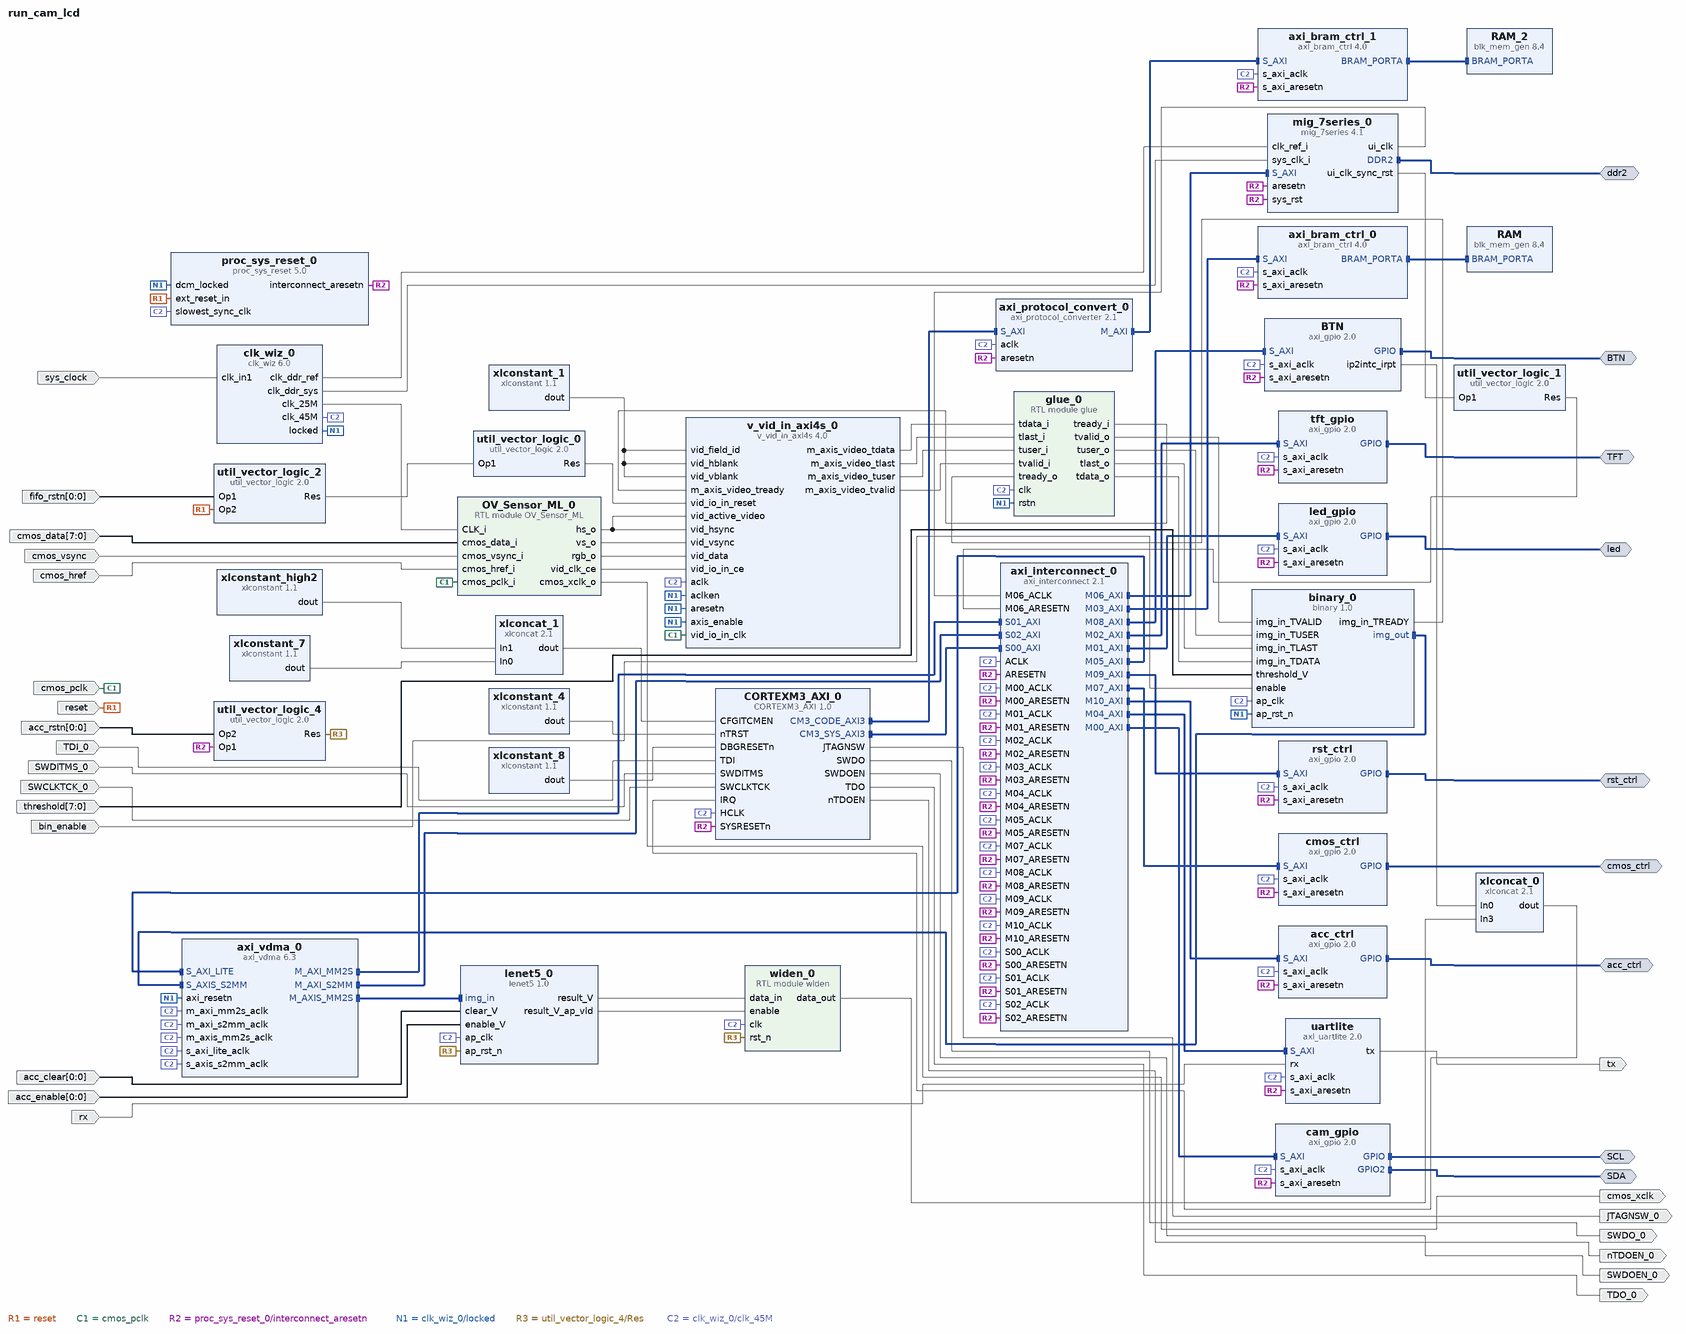
[diagram p0: block diagram of the top level]
# Vivado block design run_cam_lcd, xc7a100tcsg324-1, Vivado 2018.2
create_bd_design run_cam_lcd

create_bd_intf_port -mode Master -vlnv xilinx.com:interface:gpio_rtl:1.0 led
create_bd_intf_port -mode Master -vlnv xilinx.com:interface:gpio_rtl:1.0 TFT
create_bd_intf_port -mode Master -vlnv xilinx.com:interface:ddrx_rtl:1.0 ddr2
create_bd_intf_port -mode Master -vlnv xilinx.com:interface:gpio_rtl:1.0 SCL
create_bd_intf_port -mode Master -vlnv xilinx.com:interface:gpio_rtl:1.0 SDA
create_bd_intf_port -mode Master -vlnv xilinx.com:interface:gpio_rtl:1.0 cmos_ctrl
create_bd_intf_port -mode Master -vlnv xilinx.com:interface:gpio_rtl:1.0 BTN
create_bd_intf_port -mode Master -vlnv xilinx.com:interface:gpio_rtl:1.0 acc_ctrl
create_bd_intf_port -mode Master -vlnv xilinx.com:interface:gpio_rtl:1.0 rst_ctrl
create_bd_port -dir I -type rst reset
create_bd_port -dir I cmos_pclk
create_bd_port -dir I -type clk sys_clock
create_bd_port -dir I -from 7 -to 0 cmos_data
create_bd_port -dir I cmos_vsync
create_bd_port -dir I cmos_href
create_bd_port -dir O cmos_xclk
create_bd_port -dir I TDI_0
create_bd_port -dir I SWDITMS_0
create_bd_port -dir I -type clk SWCLKTCK_0
create_bd_port -dir O JTAGNSW_0
create_bd_port -dir O SWDO_0
create_bd_port -dir O SWDOEN_0
create_bd_port -dir O TDO_0
create_bd_port -dir O nTDOEN_0
create_bd_port -dir I rx
create_bd_port -dir O tx
create_bd_port -dir I -from 0 -to 0 fifo_rstn
create_bd_port -dir I -from 0 -to 0 acc_rstn
create_bd_port -dir I -from 0 -to 0 -type data acc_clear
set_property -dict [list \
  CONFIG.LAYERED_METADATA {xilinx.com:interface:datatypes:1.0 {DATA {datatype {name {attribs {resolve_type immediate dependency {} format string minimum {} maximum {}} value {}} bitwidth {attribs {resolve_type immediate dependency {} format long minimum {} maximum {}} value 1} bitoffset {attribs {resolve_type immediate dependency {} format long minimum {} maximum {}} value 0}}}}} \
] [get_bd_ports acc_clear]
create_bd_port -dir I -from 0 -to 0 -type data acc_enable
set_property -dict [list \
  CONFIG.LAYERED_METADATA {xilinx.com:interface:datatypes:1.0 {DATA {datatype {name {attribs {resolve_type immediate dependency {} format string minimum {} maximum {}} value {}} bitwidth {attribs {resolve_type immediate dependency {} format long minimum {} maximum {}} value 1} bitoffset {attribs {resolve_type immediate dependency {} format long minimum {} maximum {}} value 0}}}}} \
] [get_bd_ports acc_enable]
create_bd_port -dir I -from 7 -to 0 -type data threshold
set_property -dict [list \
  CONFIG.LAYERED_METADATA {xilinx.com:interface:datatypes:1.0 {DATA {datatype {name {attribs {resolve_type immediate dependency {} format string minimum {} maximum {}} value {}} bitwidth {attribs {resolve_type immediate dependency {} format long minimum {} maximum {}} value 8} bitoffset {attribs {resolve_type immediate dependency {} format long minimum {} maximum {}} value 0} integer {signed {attribs {resolve_type immediate dependency {} format bool minimum {} maximum {}} value false}}}}}} \
] [get_bd_ports threshold]
create_bd_port -dir I -type data bin_enable
set_property -dict [list \
  CONFIG.LAYERED_METADATA {xilinx.com:interface:datatypes:1.0 {DATA {datatype {name {attribs {resolve_type immediate dependency {} format string minimum {} maximum {}} value {}} bitwidth {attribs {resolve_type immediate dependency {} format long minimum {} maximum {}} value 1} bitoffset {attribs {resolve_type immediate dependency {} format long minimum {} maximum {}} value 0}}}}} \
] [get_bd_ports bin_enable]

create_bd_cell -type ip -vlnv xilinx.com:ip:clk_wiz:6.0 clk_wiz_0
set_property -dict [list \
  CONFIG.CLKOUT2_USED true \
  CONFIG.CLKOUT3_USED true \
  CONFIG.CLKOUT4_USED true \
  CONFIG.CLKOUT5_USED false \
  CONFIG.NUM_OUT_CLKS 4 \
  CONFIG.CLK_OUT1_PORT clk_25M \
  CONFIG.CLK_OUT2_PORT clk_45M \
  CONFIG.CLK_OUT3_PORT clk_ddr_ref \
  CONFIG.CLK_OUT4_PORT clk_ddr_sys \
  CONFIG.CLK_OUT5_PORT sys_tick \
  CONFIG.CLKOUT1_REQUESTED_OUT_FREQ 25.000 \
  CONFIG.CLKOUT2_REQUESTED_OUT_FREQ 40 \
  CONFIG.CLKOUT3_REQUESTED_OUT_FREQ 200.000 \
  CONFIG.CLKOUT5_REQUESTED_OUT_FREQ 10.000 \
  CONFIG.CLKOUT5_REQUESTED_PHASE 0 \
  CONFIG.CLKOUT1_DRIVES BUFGCE \
  CONFIG.CLKOUT2_DRIVES BUFGCE \
  CONFIG.CLKOUT3_DRIVES BUFGCE \
  CONFIG.CLKOUT4_DRIVES BUFGCE \
  CONFIG.CLKOUT5_DRIVES BUFGCE \
  CONFIG.CLKOUT6_DRIVES BUFGCE \
  CONFIG.CLKOUT7_DRIVES BUFGCE \
  CONFIG.FEEDBACK_SOURCE FDBK_AUTO \
  CONFIG.USE_RESET false \
  CONFIG.RESET_PORT resetn \
  CONFIG.MMCM_DIVCLK_DIVIDE 1 \
  CONFIG.MMCM_CLKFBOUT_MULT_F 10.000 \
  CONFIG.MMCM_CLKIN1_PERIOD 10.000 \
  CONFIG.MMCM_CLKIN2_PERIOD 10.000 \
  CONFIG.MMCM_CLKOUT0_DIVIDE_F 40.000 \
  CONFIG.MMCM_CLKOUT1_DIVIDE 25 \
  CONFIG.MMCM_CLKOUT2_DIVIDE 5 \
  CONFIG.MMCM_CLKOUT3_DIVIDE 10 \
  CONFIG.MMCM_CLKOUT4_DIVIDE 1 \
  CONFIG.MMCM_CLKOUT4_PHASE 0.000 \
  CONFIG.RESET_TYPE ACTIVE_LOW \
  CONFIG.USE_SAFE_CLOCK_STARTUP true \
  CONFIG.CLKOUT1_JITTER 175.402 \
  CONFIG.CLKOUT1_PHASE_ERROR 98.575 \
  CONFIG.CLKOUT2_JITTER 159.371 \
  CONFIG.CLKOUT2_PHASE_ERROR 98.575 \
  CONFIG.CLKOUT3_JITTER 114.829 \
  CONFIG.CLKOUT3_PHASE_ERROR 98.575 \
  CONFIG.CLKOUT4_JITTER 130.958 \
  CONFIG.CLKOUT4_PHASE_ERROR 98.575 \
  CONFIG.CLKOUT5_JITTER 209.588 \
  CONFIG.CLKOUT5_PHASE_ERROR 98.575 \
] [get_bd_cells clk_wiz_0]
create_bd_cell -type ip -vlnv xilinx.com:ip:proc_sys_reset:5.0 proc_sys_reset_0
create_bd_cell -type ip -vlnv Arm.com:CortexM:CORTEXM3_AXI:1.0 CORTEXM3_AXI_0
set_property -dict [list \
  CONFIG.JTAG_PRESENT true \
  CONFIG.ITCM_INIT_RAM false \
  CONFIG.TRACE_LVL 2 \
  CONFIG.DEBUG_LVL 2 \
] [get_bd_cells CORTEXM3_AXI_0]
create_bd_cell -type ip -vlnv xilinx.com:ip:axi_interconnect:2.1 axi_interconnect_0
set_property -dict [list \
  CONFIG.NUM_SI 3 \
  CONFIG.NUM_MI 11 \
  CONFIG.ENABLE_ADVANCED_OPTIONS 0 \
  CONFIG.XBAR_DATA_WIDTH 32 \
  CONFIG.SYNCHRONIZATION_STAGES 2 \
  CONFIG.M00_HAS_REGSLICE 3 \
  CONFIG.M01_HAS_REGSLICE 3 \
  CONFIG.M02_HAS_REGSLICE 3 \
  CONFIG.M03_HAS_REGSLICE 3 \
  CONFIG.M04_HAS_REGSLICE 3 \
  CONFIG.M05_HAS_REGSLICE 3 \
  CONFIG.M06_HAS_REGSLICE 3 \
  CONFIG.M07_HAS_REGSLICE 3 \
  CONFIG.M03_HAS_DATA_FIFO 0 \
  CONFIG.S00_HAS_REGSLICE 3 \
  CONFIG.S01_HAS_REGSLICE 3 \
  CONFIG.S02_HAS_REGSLICE 3 \
] [get_bd_cells axi_interconnect_0]
create_bd_cell -type ip -vlnv xilinx.com:ip:v_vid_in_axi4s:4.0 v_vid_in_axi4s_0
set_property -dict [list \
  CONFIG.C_M_AXIS_VIDEO_DATA_WIDTH 8 \
  CONFIG.C_NATIVE_COMPONENT_WIDTH 8 \
  CONFIG.C_HAS_ASYNC_CLK 1 \
  CONFIG.C_ADDR_WIDTH 10 \
] [get_bd_cells v_vid_in_axi4s_0]
create_bd_cell -type ip -vlnv xilinx.com:ip:xlconcat:2.1 xlconcat_0
set_property -dict {CONFIG.NUM_PORTS 4 CONFIG.IN4_WIDTH 10} [get_bd_cells xlconcat_0]
create_bd_cell -type ip -vlnv xilinx.com:ip:axi_gpio:2.0 led_gpio
set_property -dict {CONFIG.C_GPIO_WIDTH 5 CONFIG.C_ALL_OUTPUTS 1} [get_bd_cells led_gpio]
create_bd_cell -type ip -vlnv xilinx.com:ip:axi_gpio:2.0 tft_gpio
set_property -dict {CONFIG.C_GPIO_WIDTH 4 CONFIG.C_ALL_OUTPUTS 1} [get_bd_cells tft_gpio]
create_bd_cell -type ip -vlnv xilinx.com:ip:axi_protocol_converter:2.1 axi_protocol_convert_0
create_bd_cell -type ip -vlnv xilinx.com:ip:axi_bram_ctrl:4.0 axi_bram_ctrl_1
set_property -dict {CONFIG.SINGLE_PORT_BRAM 1} [get_bd_cells axi_bram_ctrl_1]
create_bd_cell -type ip -vlnv xilinx.com:ip:blk_mem_gen:8.4 RAM_2
set_property -dict [list \
  CONFIG.Memory_Type Single_Port_RAM \
  CONFIG.Port_A_Write_Rate 50 \
  CONFIG.EN_SAFETY_CKT false \
] [get_bd_cells RAM_2]
create_bd_cell -type ip -vlnv xilinx.com:ip:mig_7series:4.1 mig_7series_0
set_property -dict [list \
  CONFIG.XML_INPUT_FILE mig_a.prj \
  CONFIG.RESET_BOARD_INTERFACE Custom \
  CONFIG.MIG_DONT_TOUCH_PARAM Custom \
  CONFIG.BOARD_MIG_PARAM Custom \
] [get_bd_cells mig_7series_0]
create_bd_cell -type ip -vlnv xilinx.com:ip:xlconcat:2.1 xlconcat_1
create_bd_cell -type ip -vlnv xilinx.com:ip:xlconstant:1.1 xlconstant_high2
set_property -dict {CONFIG.CONST_VAL 0} [get_bd_cells xlconstant_high2]
create_bd_cell -type ip -vlnv xilinx.com:ip:axi_bram_ctrl:4.0 axi_bram_ctrl_0
set_property -dict {CONFIG.SINGLE_PORT_BRAM 1} [get_bd_cells axi_bram_ctrl_0]
create_bd_cell -type ip -vlnv xilinx.com:ip:blk_mem_gen:8.4 RAM
set_property -dict [list \
  CONFIG.Memory_Type Single_Port_RAM \
  CONFIG.Port_A_Write_Rate 50 \
  CONFIG.Port_B_Clock 0 \
  CONFIG.Port_B_Write_Rate 0 \
  CONFIG.Port_B_Enable_Rate 0 \
  CONFIG.EN_SAFETY_CKT false \
] [get_bd_cells RAM]
create_bd_cell -type ip -vlnv xilinx.com:ip:axi_gpio:2.0 cam_gpio
set_property -dict [list \
  CONFIG.C_GPIO_WIDTH 1 \
  CONFIG.C_GPIO2_WIDTH 1 \
  CONFIG.C_IS_DUAL 1 \
  CONFIG.C_ALL_OUTPUTS 1 \
  CONFIG.C_ALL_OUTPUTS_2 0 \
] [get_bd_cells cam_gpio]
create_bd_cell -type module -reference OV_Sensor_ML OV_Sensor_ML_0
create_bd_cell -type ip -vlnv xilinx.com:ip:util_vector_logic:2.0 util_vector_logic_1
set_property -dict {CONFIG.C_SIZE 1 CONFIG.C_OPERATION not} [get_bd_cells util_vector_logic_1]
create_bd_cell -type ip -vlnv xilinx.com:ip:axi_uartlite:2.0 uartlite
create_bd_cell -type ip -vlnv xilinx.com:ip:xlconstant:1.1 xlconstant_4
create_bd_cell -type ip -vlnv xilinx.com:ip:xlconstant:1.1 xlconstant_7
set_property -dict {CONFIG.CONST_VAL 0} [get_bd_cells xlconstant_7]
create_bd_cell -type ip -vlnv xilinx.com:ip:xlconstant:1.1 xlconstant_8
create_bd_cell -type ip -vlnv xilinx.com:ip:axi_gpio:2.0 cmos_ctrl
set_property -dict {CONFIG.C_GPIO_WIDTH 2 CONFIG.C_ALL_OUTPUTS 1} [get_bd_cells cmos_ctrl]
create_bd_cell -type ip -vlnv xilinx.com:ip:util_vector_logic:2.0 util_vector_logic_0
set_property -dict {CONFIG.C_SIZE 1 CONFIG.C_OPERATION not} [get_bd_cells util_vector_logic_0]
create_bd_cell -type ip -vlnv xilinx.com:ip:axi_gpio:2.0 BTN
set_property -dict {CONFIG.C_GPIO_WIDTH 5 CONFIG.C_ALL_INPUTS 1 CONFIG.C_INTERRUPT_PRESENT 1} [get_bd_cells BTN]
create_bd_cell -type ip -vlnv xilinx.com:ip:axi_gpio:2.0 acc_ctrl
set_property -dict {CONFIG.C_GPIO_WIDTH 2 CONFIG.C_ALL_OUTPUTS 1} [get_bd_cells acc_ctrl]
create_bd_cell -type ip -vlnv xilinx.com:ip:util_vector_logic:2.0 util_vector_logic_2
set_property -dict {CONFIG.C_SIZE 1 CONFIG.C_OPERATION and} [get_bd_cells util_vector_logic_2]
create_bd_cell -type ip -vlnv xilinx.com:ip:axi_gpio:2.0 rst_ctrl
set_property -dict {CONFIG.C_GPIO_WIDTH 3 CONFIG.C_DOUT_DEFAULT 0xFFFFFFFF CONFIG.C_ALL_OUTPUTS 1} [get_bd_cells rst_ctrl]
create_bd_cell -type ip -vlnv xilinx.com:ip:util_vector_logic:2.0 util_vector_logic_4
set_property -dict {CONFIG.C_SIZE 1} [get_bd_cells util_vector_logic_4]
create_bd_cell -type ip -vlnv xilinx.com:ip:xlconstant:1.1 xlconstant_1
set_property -dict {CONFIG.CONST_WIDTH 3 CONFIG.CONST_VAL 0} [get_bd_cells xlconstant_1]
create_bd_cell -type module -reference glue glue_0
create_bd_cell -type ip -vlnv xilinx.com:ip:axi_vdma:6.3 axi_vdma_0
set_property -dict [list \
  CONFIG.c_m_axi_mm2s_data_width 32 \
  CONFIG.c_m_axi_s2mm_data_width 32 \
  CONFIG.c_num_fstores 1 \
  CONFIG.c_mm2s_genlock_mode 1 \
  CONFIG.c_s2mm_genlock_mode 0 \
  CONFIG.c_mm2s_max_burst_length 16 \
  CONFIG.c_s2mm_max_burst_length 16 \
] [get_bd_cells axi_vdma_0]
create_bd_cell -type ip -vlnv xilinx.com:hls:lenet5:1.0 lenet5_0
create_bd_cell -type module -reference widen widen_0
create_bd_cell -type ip -vlnv xilinx.com:hls:binary:1.0 binary_0

# ---- connections ----

connect_bd_intf_net [get_bd_intf_pins CORTEXM3_AXI_0/CM3_SYS_AXI3] [get_bd_intf_pins axi_interconnect_0/S00_AXI]
connect_bd_intf_net [get_bd_intf_pins axi_interconnect_0/M01_AXI] [get_bd_intf_pins led_gpio/S_AXI]
connect_bd_intf_net [get_bd_intf_pins axi_interconnect_0/M02_AXI] [get_bd_intf_pins tft_gpio/S_AXI]
connect_bd_intf_net [get_bd_intf_pins CORTEXM3_AXI_0/CM3_CODE_AXI3] [get_bd_intf_pins axi_protocol_convert_0/S_AXI]
connect_bd_intf_net [get_bd_intf_pins axi_protocol_convert_0/M_AXI] [get_bd_intf_pins axi_bram_ctrl_1/S_AXI]
connect_bd_intf_net [get_bd_intf_pins RAM_2/BRAM_PORTA] [get_bd_intf_pins axi_bram_ctrl_1/BRAM_PORTA]
connect_bd_intf_net [get_bd_intf_pins axi_bram_ctrl_0/BRAM_PORTA] [get_bd_intf_pins RAM/BRAM_PORTA]
connect_bd_intf_net [get_bd_intf_pins axi_bram_ctrl_0/S_AXI] [get_bd_intf_pins axi_interconnect_0/M03_AXI]
connect_bd_intf_net [get_bd_intf_pins cam_gpio/S_AXI] [get_bd_intf_pins axi_interconnect_0/M00_AXI]
connect_bd_intf_net [get_bd_intf_pins mig_7series_0/S_AXI] [get_bd_intf_pins axi_interconnect_0/M06_AXI]
connect_bd_intf_net [get_bd_intf_pins uartlite/S_AXI] [get_bd_intf_pins axi_interconnect_0/M04_AXI]
connect_bd_intf_net [get_bd_intf_pins axi_interconnect_0/M07_AXI] [get_bd_intf_pins cmos_ctrl/S_AXI]
connect_bd_intf_net [get_bd_intf_pins axi_interconnect_0/M08_AXI] [get_bd_intf_pins BTN/S_AXI]
connect_bd_intf_net [get_bd_intf_pins acc_ctrl/S_AXI] [get_bd_intf_pins axi_interconnect_0/M10_AXI]
connect_bd_intf_net [get_bd_intf_pins rst_ctrl/S_AXI] [get_bd_intf_pins axi_interconnect_0/M09_AXI]
connect_bd_intf_net [get_bd_intf_pins axi_vdma_0/M_AXI_MM2S] [get_bd_intf_pins axi_interconnect_0/S01_AXI]
connect_bd_intf_net [get_bd_intf_pins axi_vdma_0/M_AXI_S2MM] [get_bd_intf_pins axi_interconnect_0/S02_AXI]
connect_bd_intf_net [get_bd_intf_pins axi_interconnect_0/M05_AXI] [get_bd_intf_pins axi_vdma_0/S_AXI_LITE]
connect_bd_intf_net [get_bd_intf_pins axi_vdma_0/S_AXIS_S2MM] [get_bd_intf_pins binary_0/img_out]
connect_bd_intf_net [get_bd_intf_pins axi_vdma_0/M_AXIS_MM2S] [get_bd_intf_pins lenet5_0/img_in]
connect_bd_intf_net -intf_net axi_gpio_0_GPIO [get_bd_intf_ports led] [get_bd_intf_pins led_gpio/GPIO]
connect_bd_intf_net -intf_net axi_gpio_1_GPIO [get_bd_intf_ports TFT] [get_bd_intf_pins tft_gpio/GPIO]
connect_bd_intf_net [get_bd_intf_ports ddr2] [get_bd_intf_pins mig_7series_0/DDR2]
connect_bd_intf_net [get_bd_intf_ports SCL] [get_bd_intf_pins cam_gpio/GPIO]
connect_bd_intf_net [get_bd_intf_ports SDA] [get_bd_intf_pins cam_gpio/GPIO2]
connect_bd_intf_net -intf_net axi_gpio_0_GPIO1 [get_bd_intf_ports cmos_ctrl] [get_bd_intf_pins cmos_ctrl/GPIO]
connect_bd_intf_net [get_bd_intf_ports BTN] [get_bd_intf_pins BTN/GPIO]
connect_bd_intf_net [get_bd_intf_ports acc_ctrl] [get_bd_intf_pins acc_ctrl/GPIO]
connect_bd_intf_net -intf_net soft_rstn_GPIO [get_bd_intf_ports rst_ctrl] [get_bd_intf_pins rst_ctrl/GPIO]
connect_bd_net -net ext_reset_in_0_1 [get_bd_ports reset] [get_bd_pins proc_sys_reset_0/ext_reset_in] [get_bd_pins util_vector_logic_2/Op2]
connect_bd_net [get_bd_pins clk_wiz_0/clk_25M] [get_bd_pins OV_Sensor_ML_0/CLK_i]
connect_bd_net [get_bd_pins OV_Sensor_ML_0/hs_o] [get_bd_pins v_vid_in_axi4s_0/vid_hsync] [get_bd_pins v_vid_in_axi4s_0/vid_active_video]
connect_bd_net -net cmos_pclk_i_0_1 [get_bd_ports cmos_pclk] [get_bd_pins v_vid_in_axi4s_0/vid_io_in_clk] [get_bd_pins OV_Sensor_ML_0/cmos_pclk_i]
connect_bd_net [get_bd_ports sys_clock] [get_bd_pins clk_wiz_0/clk_in1]
connect_bd_net [get_bd_pins clk_wiz_0/clk_ddr_ref] [get_bd_pins mig_7series_0/clk_ref_i]
connect_bd_net [get_bd_pins clk_wiz_0/clk_ddr_sys] [get_bd_pins mig_7series_0/sys_clk_i]
connect_bd_net [get_bd_pins xlconcat_1/dout] [get_bd_pins CORTEXM3_AXI_0/CFGITCMEN]
connect_bd_net -net xlconstant_2_dout [get_bd_pins xlconstant_high2/dout] [get_bd_pins xlconcat_1/In1]
connect_bd_net [get_bd_pins proc_sys_reset_0/interconnect_aresetn] \
  [get_bd_pins axi_protocol_convert_0/aresetn] [get_bd_pins cam_gpio/s_axi_aresetn] \
  [get_bd_pins axi_bram_ctrl_0/s_axi_aresetn] [get_bd_pins led_gpio/s_axi_aresetn] [get_bd_pins tft_gpio/s_axi_aresetn] \
  [get_bd_pins axi_bram_ctrl_1/s_axi_aresetn] [get_bd_pins CORTEXM3_AXI_0/SYSRESETn] [get_bd_pins uartlite/s_axi_aresetn] \
  [get_bd_pins cmos_ctrl/s_axi_aresetn] [get_bd_pins BTN/s_axi_aresetn] [get_bd_pins acc_ctrl/s_axi_aresetn] \
  [get_bd_pins rst_ctrl/s_axi_aresetn] [get_bd_pins util_vector_logic_4/Op1] [get_bd_pins mig_7series_0/sys_rst] \
  [get_bd_pins mig_7series_0/aresetn] [get_bd_pins axi_interconnect_0/ARESETN] [get_bd_pins axi_interconnect_0/S00_ARESETN] \
  [get_bd_pins axi_interconnect_0/M00_ARESETN] [get_bd_pins axi_interconnect_0/M01_ARESETN] \
  [get_bd_pins axi_interconnect_0/S01_ARESETN] [get_bd_pins axi_interconnect_0/S02_ARESETN] \
  [get_bd_pins axi_interconnect_0/M02_ARESETN] [get_bd_pins axi_interconnect_0/M03_ARESETN] \
  [get_bd_pins axi_interconnect_0/M04_ARESETN] [get_bd_pins axi_interconnect_0/M05_ARESETN] \
  [get_bd_pins axi_interconnect_0/M07_ARESETN] [get_bd_pins axi_interconnect_0/M08_ARESETN] \
  [get_bd_pins axi_interconnect_0/M09_ARESETN] [get_bd_pins axi_interconnect_0/M10_ARESETN]
connect_bd_net [get_bd_ports cmos_data] [get_bd_pins OV_Sensor_ML_0/cmos_data_i]
connect_bd_net [get_bd_ports cmos_vsync] [get_bd_pins OV_Sensor_ML_0/cmos_vsync_i]
connect_bd_net [get_bd_ports cmos_href] [get_bd_pins OV_Sensor_ML_0/cmos_href_i]
connect_bd_net [get_bd_pins OV_Sensor_ML_0/vs_o] [get_bd_pins v_vid_in_axi4s_0/vid_vsync]
connect_bd_net [get_bd_pins OV_Sensor_ML_0/rgb_o] [get_bd_pins v_vid_in_axi4s_0/vid_data]
connect_bd_net [get_bd_pins OV_Sensor_ML_0/vid_clk_ce] [get_bd_pins v_vid_in_axi4s_0/vid_io_in_ce]
connect_bd_net [get_bd_pins OV_Sensor_ML_0/cmos_xclk_o] [get_bd_ports cmos_xclk]
connect_bd_net [get_bd_pins clk_wiz_0/locked] \
  [get_bd_pins v_vid_in_axi4s_0/aclken] [get_bd_pins v_vid_in_axi4s_0/axis_enable] [get_bd_pins v_vid_in_axi4s_0/aresetn] \
  [get_bd_pins proc_sys_reset_0/dcm_locked] [get_bd_pins glue_0/rstn] [get_bd_pins axi_vdma_0/axi_resetn] \
  [get_bd_pins binary_0/ap_rst_n]
connect_bd_net -net TDI_0_1 [get_bd_ports TDI_0] [get_bd_pins CORTEXM3_AXI_0/TDI]
connect_bd_net -net SWDITMS_0_1 [get_bd_ports SWDITMS_0] [get_bd_pins CORTEXM3_AXI_0/SWDITMS]
connect_bd_net -net SWCLKTCK_0_1 [get_bd_ports SWCLKTCK_0] [get_bd_pins CORTEXM3_AXI_0/SWCLKTCK]
connect_bd_net [get_bd_pins CORTEXM3_AXI_0/JTAGNSW] [get_bd_ports JTAGNSW_0]
connect_bd_net [get_bd_pins CORTEXM3_AXI_0/SWDO] [get_bd_ports SWDO_0]
connect_bd_net [get_bd_pins CORTEXM3_AXI_0/SWDOEN] [get_bd_ports SWDOEN_0]
connect_bd_net [get_bd_pins CORTEXM3_AXI_0/TDO] [get_bd_ports TDO_0]
connect_bd_net [get_bd_pins CORTEXM3_AXI_0/nTDOEN] [get_bd_ports nTDOEN_0]
connect_bd_net [get_bd_pins mig_7series_0/ui_clk_sync_rst] [get_bd_pins util_vector_logic_1/Op1]
connect_bd_net [get_bd_pins util_vector_logic_1/Res] [get_bd_pins axi_interconnect_0/M06_ARESETN]
connect_bd_net [get_bd_pins mig_7series_0/ui_clk] [get_bd_pins axi_interconnect_0/M06_ACLK]
connect_bd_net -net rx_0_1 [get_bd_ports rx] [get_bd_pins uartlite/rx]
connect_bd_net -net axi_uartlite_0_tx [get_bd_pins uartlite/tx] [get_bd_ports tx]
connect_bd_net [get_bd_pins xlconstant_4/dout] [get_bd_pins CORTEXM3_AXI_0/nTRST]
connect_bd_net [get_bd_pins xlconstant_7/dout] [get_bd_pins xlconcat_1/In0]
connect_bd_net [get_bd_pins xlconstant_8/dout] [get_bd_pins CORTEXM3_AXI_0/DBGRESETn]
connect_bd_net [get_bd_pins util_vector_logic_0/Res] [get_bd_pins v_vid_in_axi4s_0/vid_io_in_reset]
connect_bd_net [get_bd_pins BTN/ip2intc_irpt] [get_bd_pins xlconcat_0/In0]
connect_bd_net [get_bd_ports fifo_rstn] [get_bd_pins util_vector_logic_2/Op1]
connect_bd_net [get_bd_pins util_vector_logic_2/Res] [get_bd_pins util_vector_logic_0/Op1]
connect_bd_net -net Op2_0_2 [get_bd_ports acc_rstn] [get_bd_pins util_vector_logic_4/Op2]
connect_bd_net [get_bd_pins util_vector_logic_4/Res] [get_bd_pins lenet5_0/ap_rst_n] [get_bd_pins widen_0/rst_n]
connect_bd_net [get_bd_pins xlconstant_1/dout] \
  [get_bd_pins v_vid_in_axi4s_0/vid_field_id] [get_bd_pins v_vid_in_axi4s_0/vid_hblank] \
  [get_bd_pins v_vid_in_axi4s_0/vid_vblank]
connect_bd_net [get_bd_pins widen_0/data_out] [get_bd_pins xlconcat_0/In3]
connect_bd_net [get_bd_pins xlconcat_0/dout] [get_bd_pins CORTEXM3_AXI_0/IRQ]
connect_bd_net [get_bd_ports acc_clear] [get_bd_pins lenet5_0/clear_V]
connect_bd_net [get_bd_ports acc_enable] [get_bd_pins lenet5_0/enable_V]
connect_bd_net [get_bd_pins v_vid_in_axi4s_0/m_axis_video_tdata] [get_bd_pins glue_0/tdata_i]
connect_bd_net [get_bd_pins v_vid_in_axi4s_0/m_axis_video_tlast] [get_bd_pins glue_0/tlast_i]
connect_bd_net [get_bd_pins v_vid_in_axi4s_0/m_axis_video_tuser] [get_bd_pins glue_0/tuser_i]
connect_bd_net [get_bd_pins v_vid_in_axi4s_0/m_axis_video_tvalid] [get_bd_pins glue_0/tvalid_i]
connect_bd_net [get_bd_pins glue_0/tready_i] [get_bd_pins v_vid_in_axi4s_0/m_axis_video_tready]
connect_bd_net [get_bd_pins glue_0/tvalid_o] [get_bd_pins binary_0/img_in_TVALID]
connect_bd_net [get_bd_pins glue_0/tuser_o] [get_bd_pins binary_0/img_in_TUSER]
connect_bd_net [get_bd_pins binary_0/img_in_TREADY] [get_bd_pins glue_0/tready_o]
connect_bd_net [get_bd_pins glue_0/tlast_o] [get_bd_pins binary_0/img_in_TLAST]
connect_bd_net [get_bd_pins glue_0/tdata_o] [get_bd_pins binary_0/img_in_TDATA]
connect_bd_net [get_bd_pins lenet5_0/result_V] [get_bd_pins widen_0/data_in]
connect_bd_net [get_bd_pins lenet5_0/result_V_ap_vld] [get_bd_pins widen_0/enable]
connect_bd_net -net threshold_V_0_1 [get_bd_ports threshold] [get_bd_pins binary_0/threshold_V]
connect_bd_net -net enable_0_1 [get_bd_ports bin_enable] [get_bd_pins binary_0/enable]
connect_bd_net [get_bd_pins clk_wiz_0/clk_45M] \
  [get_bd_pins v_vid_in_axi4s_0/aclk] [get_bd_pins glue_0/clk] [get_bd_pins axi_vdma_0/m_axi_mm2s_aclk] \
  [get_bd_pins axi_vdma_0/m_axis_mm2s_aclk] [get_bd_pins axi_vdma_0/m_axi_s2mm_aclk] \
  [get_bd_pins axi_vdma_0/s_axis_s2mm_aclk] [get_bd_pins axi_vdma_0/s_axi_lite_aclk] [get_bd_pins lenet5_0/ap_clk] \
  [get_bd_pins CORTEXM3_AXI_0/HCLK] [get_bd_pins BTN/s_axi_aclk] [get_bd_pins cam_gpio/s_axi_aclk] \
  [get_bd_pins led_gpio/s_axi_aclk] [get_bd_pins axi_bram_ctrl_0/s_axi_aclk] [get_bd_pins rst_ctrl/s_axi_aclk] \
  [get_bd_pins uartlite/s_axi_aclk] [get_bd_pins acc_ctrl/s_axi_aclk] [get_bd_pins cmos_ctrl/s_axi_aclk] \
  [get_bd_pins tft_gpio/s_axi_aclk] [get_bd_pins axi_protocol_convert_0/aclk] [get_bd_pins axi_bram_ctrl_1/s_axi_aclk] \
  [get_bd_pins proc_sys_reset_0/slowest_sync_clk] [get_bd_pins widen_0/clk] [get_bd_pins axi_interconnect_0/ACLK] \
  [get_bd_pins axi_interconnect_0/S00_ACLK] [get_bd_pins axi_interconnect_0/M00_ACLK] \
  [get_bd_pins axi_interconnect_0/M01_ACLK] [get_bd_pins axi_interconnect_0/S01_ACLK] \
  [get_bd_pins axi_interconnect_0/S02_ACLK] [get_bd_pins axi_interconnect_0/M02_ACLK] \
  [get_bd_pins axi_interconnect_0/M03_ACLK] [get_bd_pins axi_interconnect_0/M04_ACLK] \
  [get_bd_pins axi_interconnect_0/M05_ACLK] [get_bd_pins axi_interconnect_0/M07_ACLK] \
  [get_bd_pins axi_interconnect_0/M08_ACLK] [get_bd_pins axi_interconnect_0/M09_ACLK] \
  [get_bd_pins axi_interconnect_0/M10_ACLK] [get_bd_pins binary_0/ap_clk]

# ---- address map ----
assign_bd_address -offset 0x80000000 -range 128M -target_address_space [get_bd_addr_spaces axi_vdma_0/Data_MM2S] [get_bd_addr_segs mig_7series_0/memmap/memaddr]
exclude_bd_addr_seg -offset 0x40400000 -range 64K -target_address_space [get_bd_addr_spaces axi_vdma_0/Data_MM2S] [get_bd_addr_segs axi_vdma_0/S_AXI_LITE/Reg]
assign_bd_address -offset 0x80000000 -range 128M -target_address_space [get_bd_addr_spaces axi_vdma_0/Data_S2MM] [get_bd_addr_segs mig_7series_0/memmap/memaddr]
exclude_bd_addr_seg -offset 0x40400000 -range 64K -target_address_space [get_bd_addr_spaces axi_vdma_0/Data_S2MM] [get_bd_addr_segs axi_vdma_0/S_AXI_LITE/Reg]
assign_bd_address -offset 0x00000000 -range 256K -target_address_space [get_bd_addr_spaces CORTEXM3_AXI_0/CM3_CODE_AXI3] [get_bd_addr_segs axi_bram_ctrl_1/S_AXI/Mem0]
assign_bd_address -offset 0x40000000 -range 4K -target_address_space [get_bd_addr_spaces CORTEXM3_AXI_0/CM3_SYS_AXI3] [get_bd_addr_segs cam_gpio/S_AXI/Reg]
assign_bd_address -offset 0x40010000 -range 4K -target_address_space [get_bd_addr_spaces CORTEXM3_AXI_0/CM3_SYS_AXI3] [get_bd_addr_segs cmos_ctrl/S_AXI/Reg]
assign_bd_address -offset 0x40020000 -range 4K -target_address_space [get_bd_addr_spaces CORTEXM3_AXI_0/CM3_SYS_AXI3] [get_bd_addr_segs BTN/S_AXI/Reg]
assign_bd_address -offset 0x40040000 -range 64K -target_address_space [get_bd_addr_spaces CORTEXM3_AXI_0/CM3_SYS_AXI3] [get_bd_addr_segs acc_ctrl/S_AXI/Reg]
assign_bd_address -offset 0x40050000 -range 64K -target_address_space [get_bd_addr_spaces CORTEXM3_AXI_0/CM3_SYS_AXI3] [get_bd_addr_segs rst_ctrl/S_AXI/Reg]
assign_bd_address -offset 0x40110000 -range 4K -target_address_space [get_bd_addr_spaces CORTEXM3_AXI_0/CM3_SYS_AXI3] [get_bd_addr_segs led_gpio/S_AXI/Reg]
assign_bd_address -offset 0x40120000 -range 4K -target_address_space [get_bd_addr_spaces CORTEXM3_AXI_0/CM3_SYS_AXI3] [get_bd_addr_segs tft_gpio/S_AXI/Reg]
assign_bd_address -offset 0x40140000 -range 4K -target_address_space [get_bd_addr_spaces CORTEXM3_AXI_0/CM3_SYS_AXI3] [get_bd_addr_segs uartlite/S_AXI/Reg]
assign_bd_address -offset 0x40400000 -range 64K -target_address_space [get_bd_addr_spaces CORTEXM3_AXI_0/CM3_SYS_AXI3] [get_bd_addr_segs axi_vdma_0/S_AXI_LITE/Reg]
assign_bd_address -offset 0x60000000 -range 64K -target_address_space [get_bd_addr_spaces CORTEXM3_AXI_0/CM3_SYS_AXI3] [get_bd_addr_segs axi_bram_ctrl_0/S_AXI/Mem0]
assign_bd_address -offset 0x80000000 -range 128M -target_address_space [get_bd_addr_spaces CORTEXM3_AXI_0/CM3_SYS_AXI3] [get_bd_addr_segs mig_7series_0/memmap/memaddr]

validate_bd_design
save_bd_design
